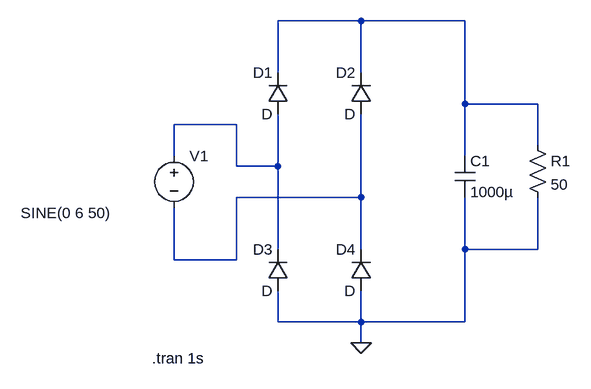
[diagram p0: schematic simple_power_source.asc]
simple_power_source.asc, the LTspice schematic file:
Version 4
SHEET 1 880 680
WIRE 320 -80 192 -80
WIRE 480 -80 320 -80
WIRE 192 0 192 -80
WIRE 320 0 320 -80
WIRE 480 48 480 -80
WIRE 592 48 480 48
WIRE 128 80 32 80
WIRE 592 112 592 48
WIRE 32 128 32 80
WIRE 480 128 480 48
WIRE 128 144 128 80
WIRE 192 144 192 64
WIRE 192 144 128 144
WIRE 320 192 320 64
WIRE 320 192 128 192
WIRE 192 272 192 144
WIRE 320 272 320 192
WIRE 480 272 480 192
WIRE 592 272 592 192
WIRE 592 272 480 272
WIRE 32 288 32 208
WIRE 128 288 128 192
WIRE 128 288 32 288
WIRE 192 384 192 336
WIRE 320 384 320 336
WIRE 320 384 192 384
WIRE 480 384 480 272
WIRE 480 384 320 384
WIRE 320 416 320 384
FLAG 320 416 0
SYMBOL voltage 32 112 R0
WINDOW 3 -236 104 Left 2
WINDOW 123 0 0 Left 0
WINDOW 39 0 0 Left 0
SYMATTR InstName V1
SYMATTR Value SINE(0 6 50)
SYMBOL diode 208 64 R180
WINDOW 0 24 64 Left 2
WINDOW 3 24 0 Left 2
SYMATTR InstName D1
SYMBOL diode 336 64 R180
WINDOW 0 24 64 Left 2
WINDOW 3 24 0 Left 2
SYMATTR InstName D2
SYMBOL diode 208 336 R180
WINDOW 0 24 64 Left 2
WINDOW 3 24 0 Left 2
SYMATTR InstName D3
SYMBOL diode 336 336 R180
WINDOW 0 24 64 Left 2
WINDOW 3 24 0 Left 2
SYMATTR InstName D4
SYMBOL cap 464 128 R0
SYMATTR InstName C1
SYMATTR Value 1000µ
SYMBOL res 576 96 R0
SYMATTR InstName R1
SYMATTR Value 50
TEXT -2 440 Left 2 !.tran 1s

The netlist it stands for:
* simple_power_source.asc
V1 N002 N003 SINE(0 6 50)
D1 N002 N001 D
D2 N003 N001 D
D3 0 N002 D
D4 0 N003 D
C1 N001 0 1000µ
R1 N001 0 50
.model D D
.lib standard.dio
.tran 1s
.backanno
.end